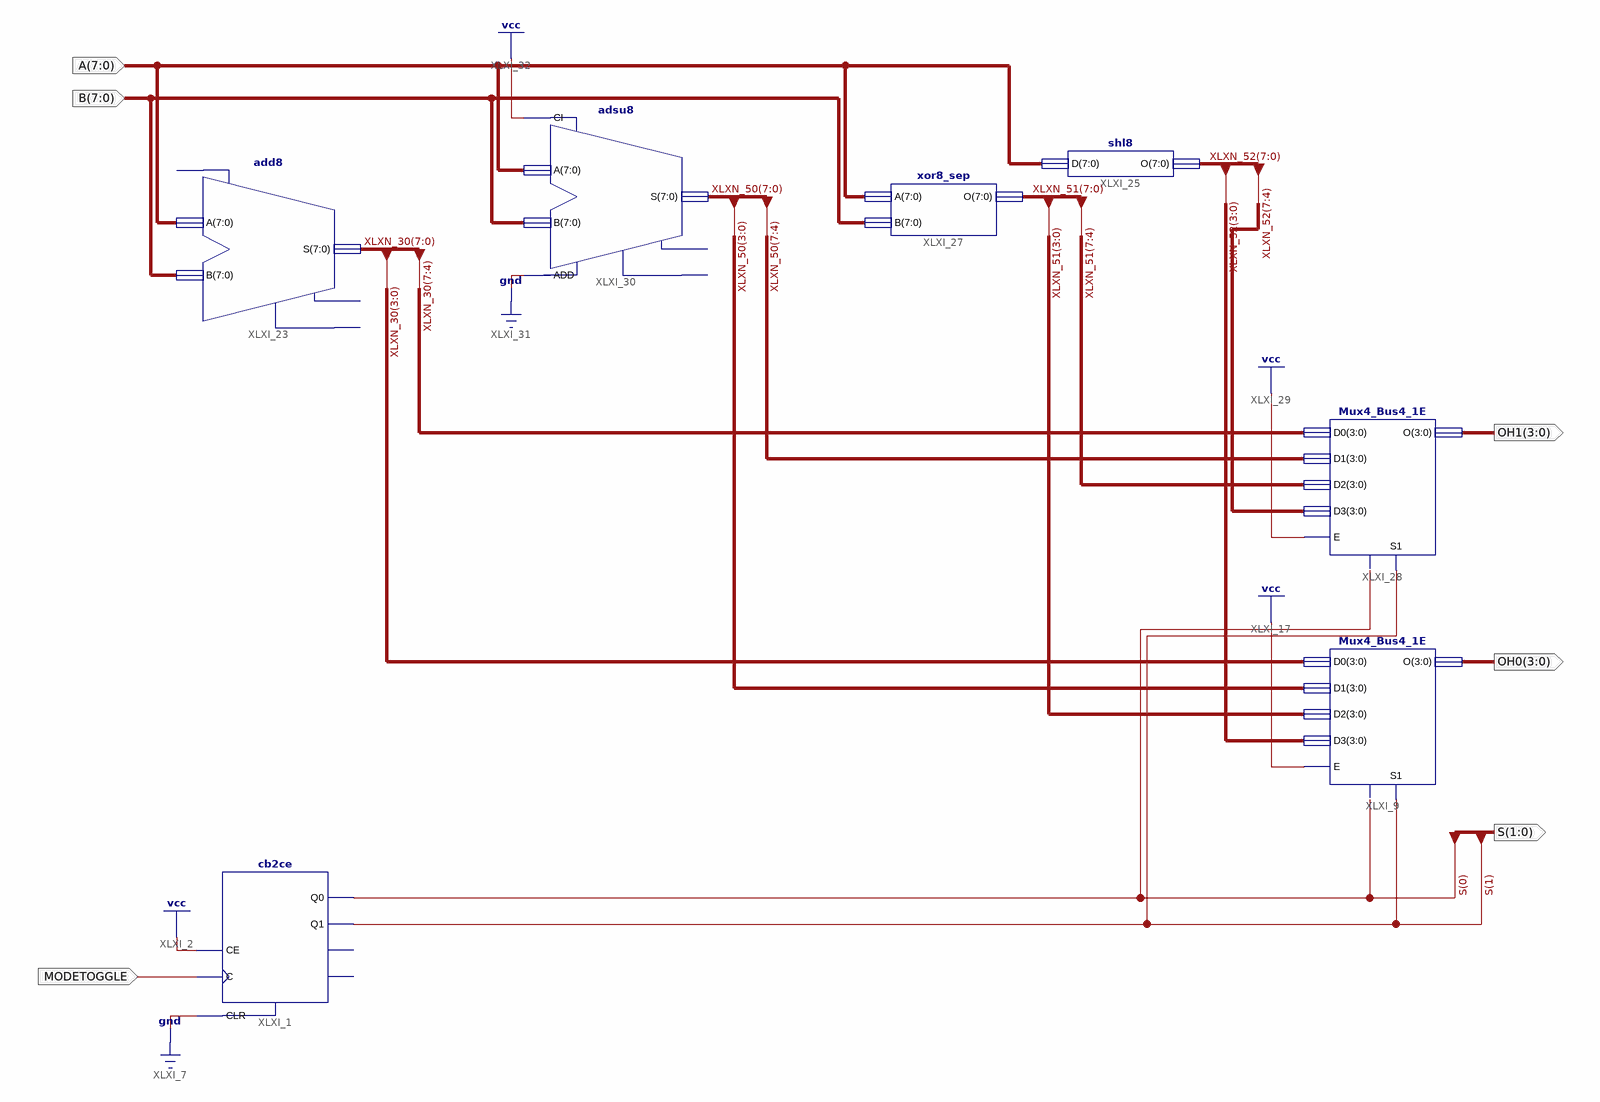
[diagram p0: schematic sheet 1]
// Xilinx ISE schematic processor.sch (spartan6) as structural Verilog: 7 symbols, 6 ports
module processor (
  input  [7:0] A,
  input  [7:0] B,
  input  MODETOGGLE,
  output [3:0] OH0,
  output [3:0] OH1,
  output [1:0] S
);

  wire [7:0] XLXN_30, XLXN_50, XLXN_51, XLXN_52;

  Mux4_Bus4_1E XLXI_9 (
    .D0(XLXN_30[3:0]), .O(OH0), .E(1'b1), .S1(S[1]), .S0(S[0]), .D1(XLXN_50[3:0]), .D2(XLXN_51[3:0]),
    .D3(XLXN_52[3:0]));
  cb2ce XLXI_1 (.C(MODETOGGLE), .CE(1'b1), .CLR(1'b0), .Q0(S[0]), .Q1(S[1]));  // open: CEO, TC
  add8 XLXI_23 (.A(A), .B(B), .S(XLXN_30));  // open: CI, CO, OFL
  shl8 XLXI_25 (.D(A), .O(XLXN_52));
  xor8_sep XLXI_27 (.A(A), .B(B), .O(XLXN_51));
  Mux4_Bus4_1E XLXI_28 (
    .D0(XLXN_30[7:4]), .O(OH1), .E(1'b1), .S1(S[1]), .S0(S[0]), .D1(XLXN_50[7:4]), .D2(XLXN_51[7:4]),
    .D3(XLXN_52[7:4]));
  adsu8 XLXI_30 (.A(A), .ADD(1'b0), .B(B), .CI(1'b1), .S(XLXN_50));  // open: CO, OFL
endmodule
